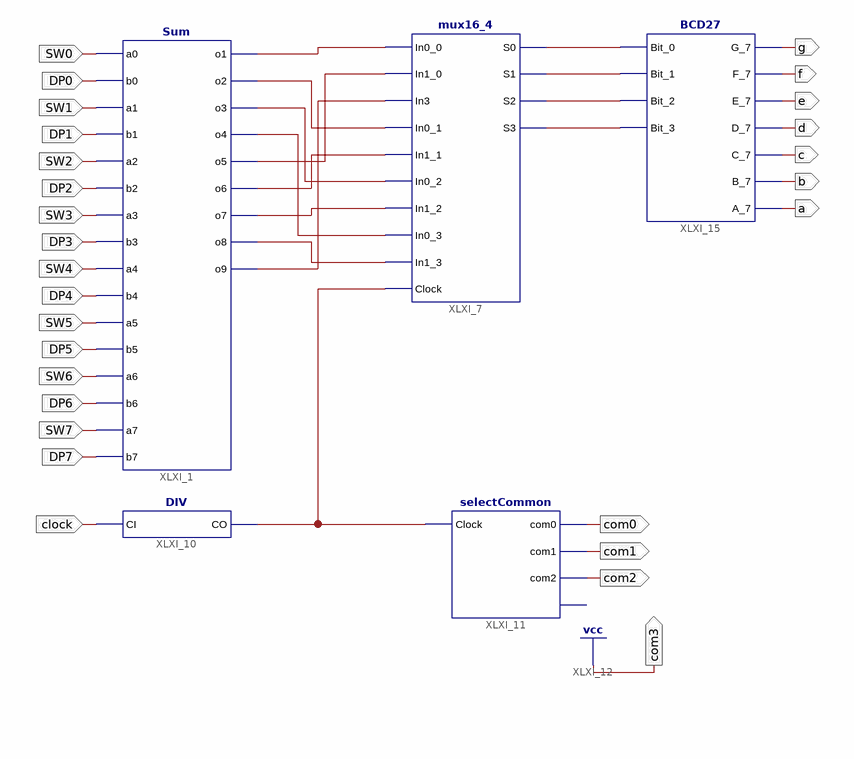
[diagram p0: schematic sheet 1]
// Xilinx ISE schematic Lab8.sch (spartan6) as structural Verilog: 5 symbols, 28 ports
module Lab8 (
  input  DP7,
  input  SW7,
  input  DP6,
  input  SW6,
  input  DP5,
  input  SW5,
  input  DP4,
  input  SW4,
  input  DP3,
  input  SW3,
  input  DP2,
  input  SW2,
  input  DP1,
  input  SW1,
  input  DP0,
  input  SW0,
  input  clock,
  output com0,
  output com1,
  output com2,
  output com3,
  output g,
  output f,
  output e,
  output d,
  output c,
  output b,
  output a
);

  wire XLXN_39, XLXN_44, XLXN_45, XLXN_46, XLXN_47, XLXN_48, XLXN_49, XLXN_50, XLXN_51, XLXN_52, XLXN_53,
       XLXN_54, XLXN_55, XLXN_64;

  Sum XLXI_1 (
    .a0(SW0), .a1(SW1), .a2(SW2), .a3(SW3), .a4(SW4), .a5(SW5), .a6(SW6), .a7(SW7), .b0(DP0), .b1(DP1),
    .b2(DP2), .b3(DP3), .b4(DP4), .b5(DP5), .b6(DP6), .b7(DP7), .o1(XLXN_44), .o2(XLXN_45), .o3(XLXN_46),
    .o4(XLXN_47), .o5(XLXN_48), .o6(XLXN_49), .o7(XLXN_50), .o8(XLXN_51), .o9(XLXN_39));
  mux16_4 XLXI_7 (
    .Clock(XLXN_64), .In0_0(XLXN_44), .In0_1(XLXN_45), .In0_2(XLXN_46), .In0_3(XLXN_47), .In1_0(XLXN_48),
    .In1_1(XLXN_49), .In1_2(XLXN_50), .In1_3(XLXN_51), .In3(XLXN_39), .S0(XLXN_52), .S1(XLXN_53),
    .S2(XLXN_54), .S3(XLXN_55));
  DIV XLXI_10 (.CI(clock), .CO(XLXN_64));
  selectCommon XLXI_11 (.Clock(XLXN_64), .com0(com0), .com1(com1), .com2(com2));  // open: com3
  BCD27 XLXI_15 (
    .A_7(a), .Bit_0(XLXN_52), .Bit_1(XLXN_53), .Bit_2(XLXN_54), .Bit_3(XLXN_55), .B_7(b), .C_7(c), .D_7(d),
    .E_7(e), .F_7(f), .G_7(g));

  assign com3 = 1'b1;
endmodule
